# EAGLE design colourgrid3-r1 (EAGLE 5.12)
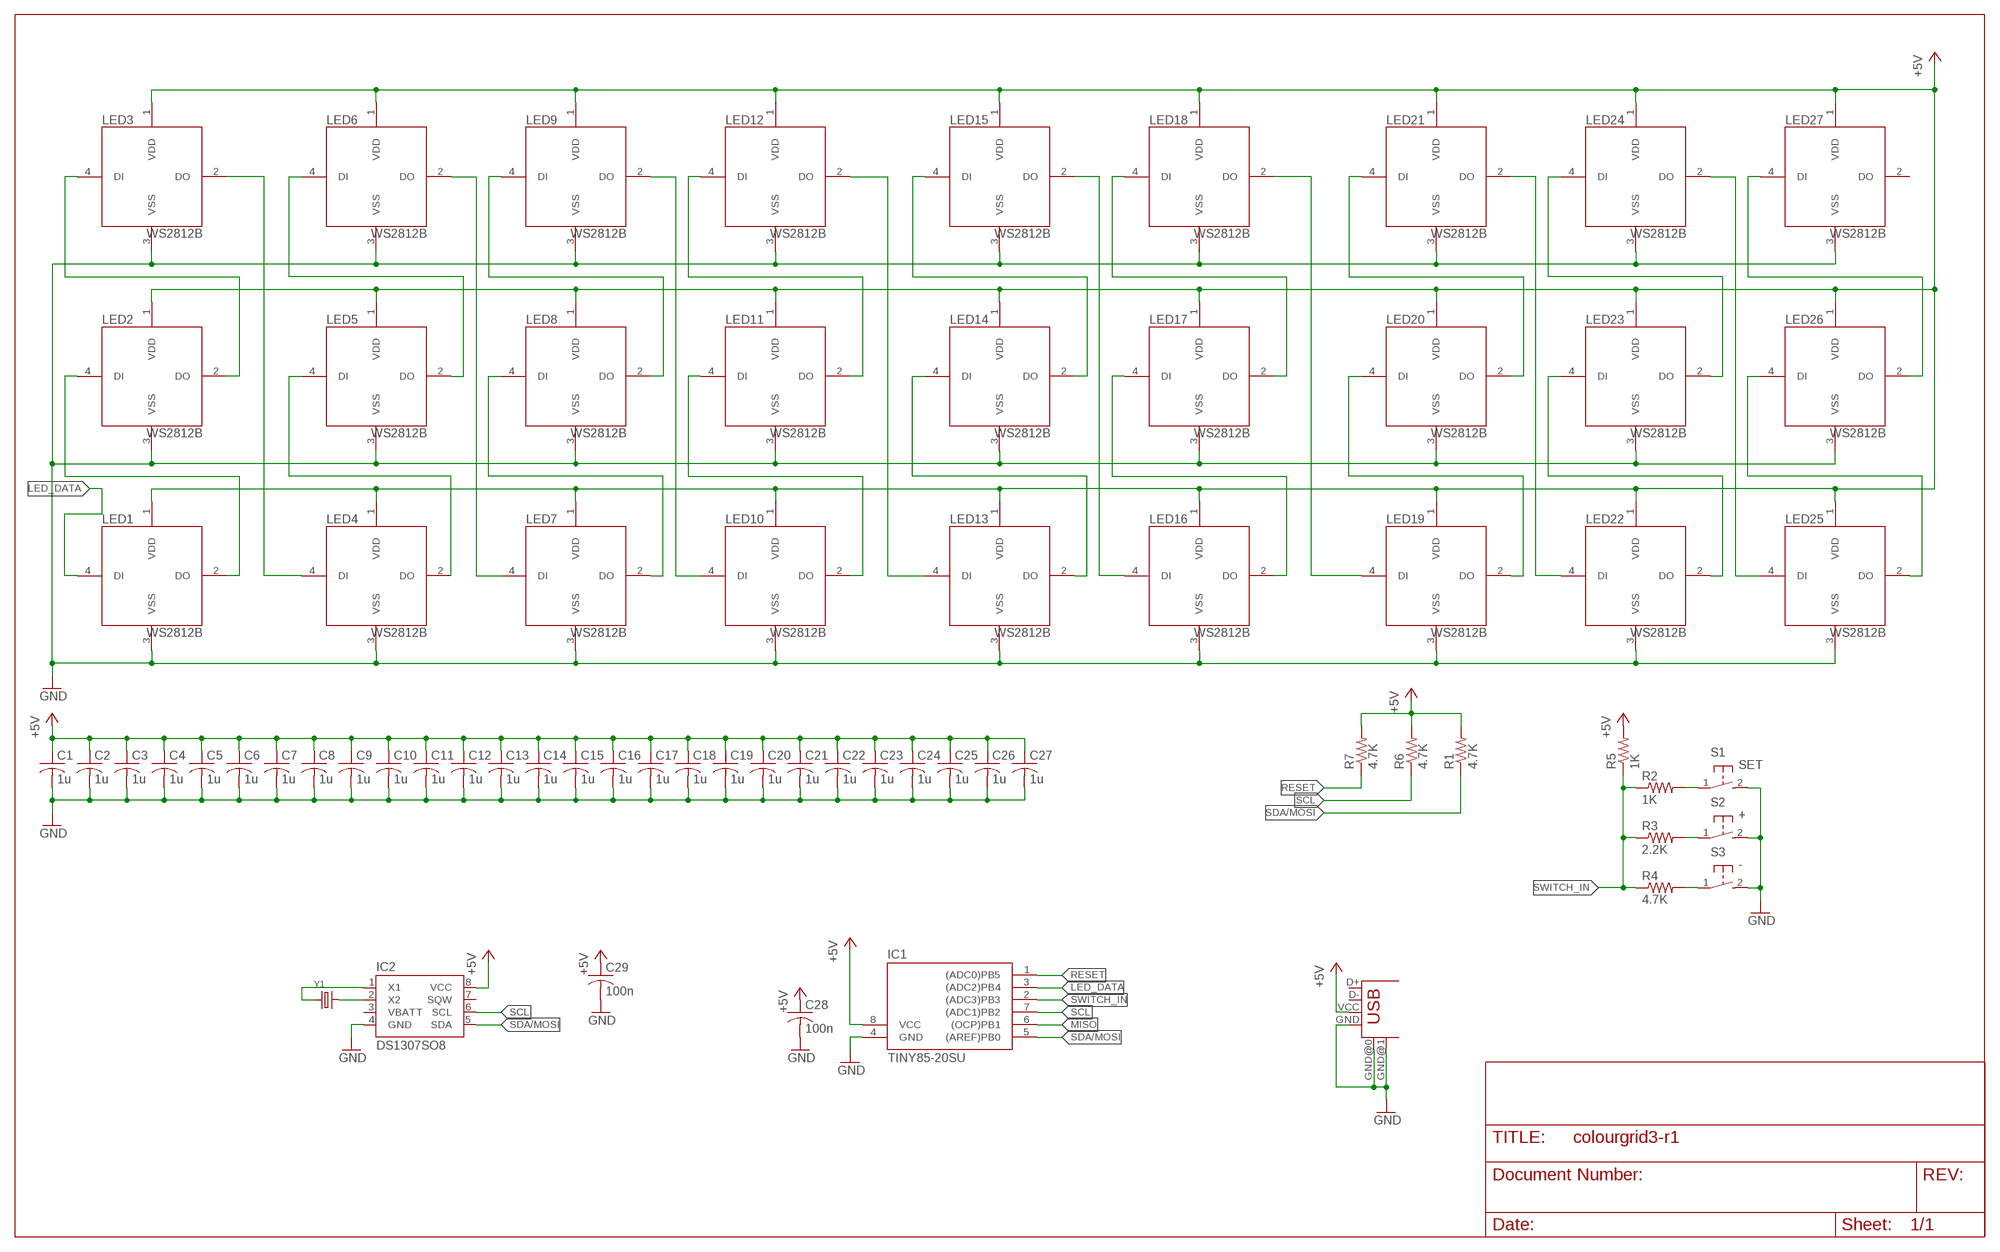
[diagram p0: schematic, sheet 1]

## Parts
C1  1u  C-USC0402  [C0402]
C2  1u  C-USC0402  [C0402]
C3  1u  C-USC0402  [C0402]
C4  1u  C-USC0402  [C0402]
C5  1u  C-USC0402  [C0402]
C6  1u  C-USC0402  [C0402]
C7  1u  C-USC0402  [C0402]
C8  1u  C-USC0402  [C0402]
C9  1u  C-USC0402  [C0402]
C10  1u  C-USC0402  [C0402]
C11  1u  C-USC0402  [C0402]
C12  1u  C-USC0402  [C0402]
C13  1u  C-USC0402  [C0402]
C14  1u  C-USC0402  [C0402]
C15  1u  C-USC0402  [C0402]
C16  1u  C-USC0402  [C0402]
C17  1u  C-USC0402  [C0402]
C18  1u  C-USC0402  [C0402]
C19  1u  C-USC0402  [C0402]
C20  1u  C-USC0402  [C0402]
C21  1u  C-USC0402  [C0402]
C22  1u  C-USC0402  [C0402]
C23  1u  C-USC0402  [C0402]
C24  1u  C-USC0402  [C0402]
C25  1u  C-USC0402  [C0402]
C26  1u  C-USC0402  [C0402]
C27  1u  C-USC0402  [C0402]
C28  100n  C-USC0402  [C0402]
C29  100n  C-USC0402  [C0402]
IC1  TINY85-20SU  TINY25-20SU  [SOIC8]
IC2  DS1307SO8  [SO08]
LED1  WS2812B  [LED-TRICOLOR-5050-4PIN]
LED2  WS2812B  [LED-TRICOLOR-5050-4PIN]
LED3  WS2812B  [LED-TRICOLOR-5050-4PIN]
LED4  WS2812B  [LED-TRICOLOR-5050-4PIN]
LED5  WS2812B  [LED-TRICOLOR-5050-4PIN]
LED6  WS2812B  [LED-TRICOLOR-5050-4PIN]
LED7  WS2812B  [LED-TRICOLOR-5050-4PIN]
LED8  WS2812B  [LED-TRICOLOR-5050-4PIN]
LED9  WS2812B  [LED-TRICOLOR-5050-4PIN]
LED10  WS2812B  [LED-TRICOLOR-5050-4PIN]
LED11  WS2812B  [LED-TRICOLOR-5050-4PIN]
LED12  WS2812B  [LED-TRICOLOR-5050-4PIN]
LED13  WS2812B  [LED-TRICOLOR-5050-4PIN]
LED14  WS2812B  [LED-TRICOLOR-5050-4PIN]
LED15  WS2812B  [LED-TRICOLOR-5050-4PIN]
LED16  WS2812B  [LED-TRICOLOR-5050-4PIN]
LED17  WS2812B  [LED-TRICOLOR-5050-4PIN]
LED18  WS2812B  [LED-TRICOLOR-5050-4PIN]
LED19  WS2812B  [LED-TRICOLOR-5050-4PIN]
LED20  WS2812B  [LED-TRICOLOR-5050-4PIN]
LED21  WS2812B  [LED-TRICOLOR-5050-4PIN]
LED22  WS2812B  [LED-TRICOLOR-5050-4PIN]
LED23  WS2812B  [LED-TRICOLOR-5050-4PIN]
LED24  WS2812B  [LED-TRICOLOR-5050-4PIN]
LED25  WS2812B  [LED-TRICOLOR-5050-4PIN]
LED26  WS2812B  [LED-TRICOLOR-5050-4PIN]
LED27  WS2812B  [LED-TRICOLOR-5050-4PIN]
R1  4.7K  R-US_R0402  [R0402]
R2  1K  R-US_R0402  [R0402]
R3  2.2K  R-US_R0402  [R0402]
R4  4.7K  R-US_R0402  [R0402]
R5  1K  R-US_R0402  [R0402]
R6  4.7K  R-US_R0402  [R0402]
R7  4.7K  R-US_R0402  [R0402]
S1  SET  TACT-SPSTSMD-6X3.6  [6X3.6-SPST]
S2  +  TACT-SPSTSMD-6X3.6  [6X3.6-SPST]
S3  -  TACT-SPSTSMD-6X3.6  [6X3.6-SPST]
USB1  USB-U  [USB-MICROB-ALI]
Y1  CRYSTAL32.768  [CRYSTAL32SMT]

## Nets
+5V: C1.1 C2.1 C3.1 C4.1 C5.1 C6.1 C7.1 C8.1 C9.1 C10.1 C11.1 C12.1 C13.1 C14.1 C15.1 C16.1 C17.1 C18.1 C19.1 C20.1 C21.1 C22.1 C23.1 C24.1 C25.1 C26.1 C27.1 C28.1 C29.1 IC1.8(VCC) IC2.8(VCC) LED1.1(VDD) LED2.1(VDD) LED3.1(VDD) LED4.1(VDD) LED5.1(VDD) LED6.1(VDD) LED7.1(VDD) LED8.1(VDD) LED9.1(VDD) LED10.1(VDD) LED11.1(VDD) LED12.1(VDD) LED13.1(VDD) LED14.1(VDD) LED15.1(VDD) LED16.1(VDD) LED17.1(VDD) LED18.1(VDD) LED19.1(VDD) LED20.1(VDD) LED21.1(VDD) LED22.1(VDD) LED23.1(VDD) LED24.1(VDD) LED25.1(VDD) LED26.1(VDD) LED27.1(VDD) R1.2 R5.2 R6.2 R7.2 USB1.VCC(VBUS)
GND: C1.2 C2.2 C3.2 C4.2 C5.2 C6.2 C7.2 C8.2 C9.2 C10.2 C11.2 C12.2 C13.2 C14.2 C15.2 C16.2 C17.2 C18.2 C19.2 C20.2 C21.2 C22.2 C23.2 C24.2 C25.2 C26.2 C27.2 C28.2 C29.2 IC1.4(GND) IC2.4(GND) LED1.3(VSS) LED2.3(VSS) LED3.3(VSS) LED4.3(VSS) LED5.3(VSS) LED6.3(VSS) LED7.3(VSS) LED8.3(VSS) LED9.3(VSS) LED10.3(VSS) LED11.3(VSS) LED12.3(VSS) LED13.3(VSS) LED14.3(VSS) LED15.3(VSS) LED16.3(VSS) LED17.3(VSS) LED18.3(VSS) LED19.3(VSS) LED20.3(VSS) LED21.3(VSS) LED22.3(VSS) LED23.3(VSS) LED24.3(VSS) LED25.3(VSS) LED26.3(VSS) LED27.3(VSS) S1.2(S) S2.2(S) S3.2(S) USB1.GND USB1.GND@0(GND) USB1.GND@1(GND)
LED_DATA: IC1.3((ADC2)PB4) LED1.4(DI)
MISO: IC1.6((OCP)PB1)
N$1: LED1.2(DO) LED2.4(DI)
N$2: LED2.2(DO) LED3.4(DI)
N$3: LED3.2(DO) LED4.4(DI)
N$4: LED4.2(DO) LED5.4(DI)
N$5: LED5.2(DO) LED6.4(DI)
N$6: LED6.2(DO) LED7.4(DI)
N$7: LED9.2(DO) LED10.4(DI)
N$8: LED7.2(DO) LED8.4(DI)
N$9: LED10.2(DO) LED11.4(DI)
N$10: LED8.2(DO) LED9.4(DI)
N$11: LED11.2(DO) LED12.4(DI)
N$12: LED12.2(DO) LED13.4(DI)
N$13: LED13.2(DO) LED14.4(DI)
N$14: LED14.2(DO) LED15.4(DI)
N$15: LED17.2(DO) LED18.4(DI)
N$16: LED16.2(DO) LED17.4(DI)
N$17: LED15.2(DO) LED16.4(DI)
N$18: LED20.2(DO) LED21.4(DI)
N$19: LED21.2(DO) LED22.4(DI)
N$20: LED19.2(DO) LED20.4(DI)
N$21: LED22.2(DO) LED23.4(DI)
N$22: LED23.2(DO) LED24.4(DI)
N$23: LED24.2(DO) LED25.4(DI)
N$24: LED25.2(DO) LED26.4(DI)
N$25: LED26.2(DO) LED27.4(DI)
N$26: LED18.2(DO) LED19.4(DI)
N$27: IC2.1(X1) Y1.1
N$28: IC2.2(X2) Y1.2
N$29: R2.2 S1.1(P)
N$30: R3.2 S2.1(P)
N$31: R4.2 S3.1(P)
RESET: IC1.1((ADC0)PB5) R7.1
SCL: IC1.7((ADC1)PB2) IC2.6(SCL) R6.1
SDA/MOSI: IC1.5((AREF)PB0) IC2.5(SDA) R1.1
SWITCH_IN: IC1.2((ADC3)PB3) R2.1 R3.1 R4.1 R5.1
Unconnected: IC2.3(VBATT) IC2.7(SQW) LED27.2(DO) USB1.D+ USB1.D-

## Library data of the parts
C1-C29 = rcl:C-US: CAPACITOR, American symbol
IC1 = avr-5-4.16:TINY25
IC2 = SparkFun:DS1307
LED1-LED27 = rbg-worldsemi-led:WS2812B
R1-R7 = rcl:R-US_: RESISTOR, American symbol
S1-S3 = rbg-generic-tact-switch:TACT-SPST
USB1 = con-usb-2:USB: USB Connectors
Y1 = microbuilder:CRYSTAL: Crystals HC49UP - Surface Mount Crystal 4.0MHz 18pF +/-30ppm Surface Mount Crystal [Digikey: 535-9857-1-ND] 12.0 MHz Surface Mount Crystal [Digikey: 535-9869-6-ND] 25.0 MHz Surface Mount Crystal [Digikey: 535-9078-1-ND] 3.2 x 2.5mm - MEMs SMT Crystal 12.0 MHz 8pF 15ppm 3.2 x 2.5mm Crystal [Digikey: -10-70°C: 644-1047-1-ND -40-125°C: 644-1128-1-ND] 16.0 MHz 8pF 15ppm 3.2 x 2.5mm Crystal [Digikey: -10-70°C: 644-1049-1-ND -40-125°C: 644-1129-2-ND] 16.0 MHz 10pF 10ppm 3.2 x 2.5mm Crystal [Digikey: 644-1100-1-ND] 27.12 MHz 18pF 30ppm 3.2 x 2.5mm Crystal [Digikey: 887-1424-1-ND] 27.12MHz 10pF 10ppm 3.2 x 2.5mm Crystal [Digikey: 887-1329-1-ND] 4.9 x 1.8mm - MEMs SMT Crystal 32.768 KHz 12.5pF 20ppm 4.9 x 1.8mm Crystal [Digikey: SE2415CT-ND] Cylinder 32.768KHz Cylinder Crystal

## Board
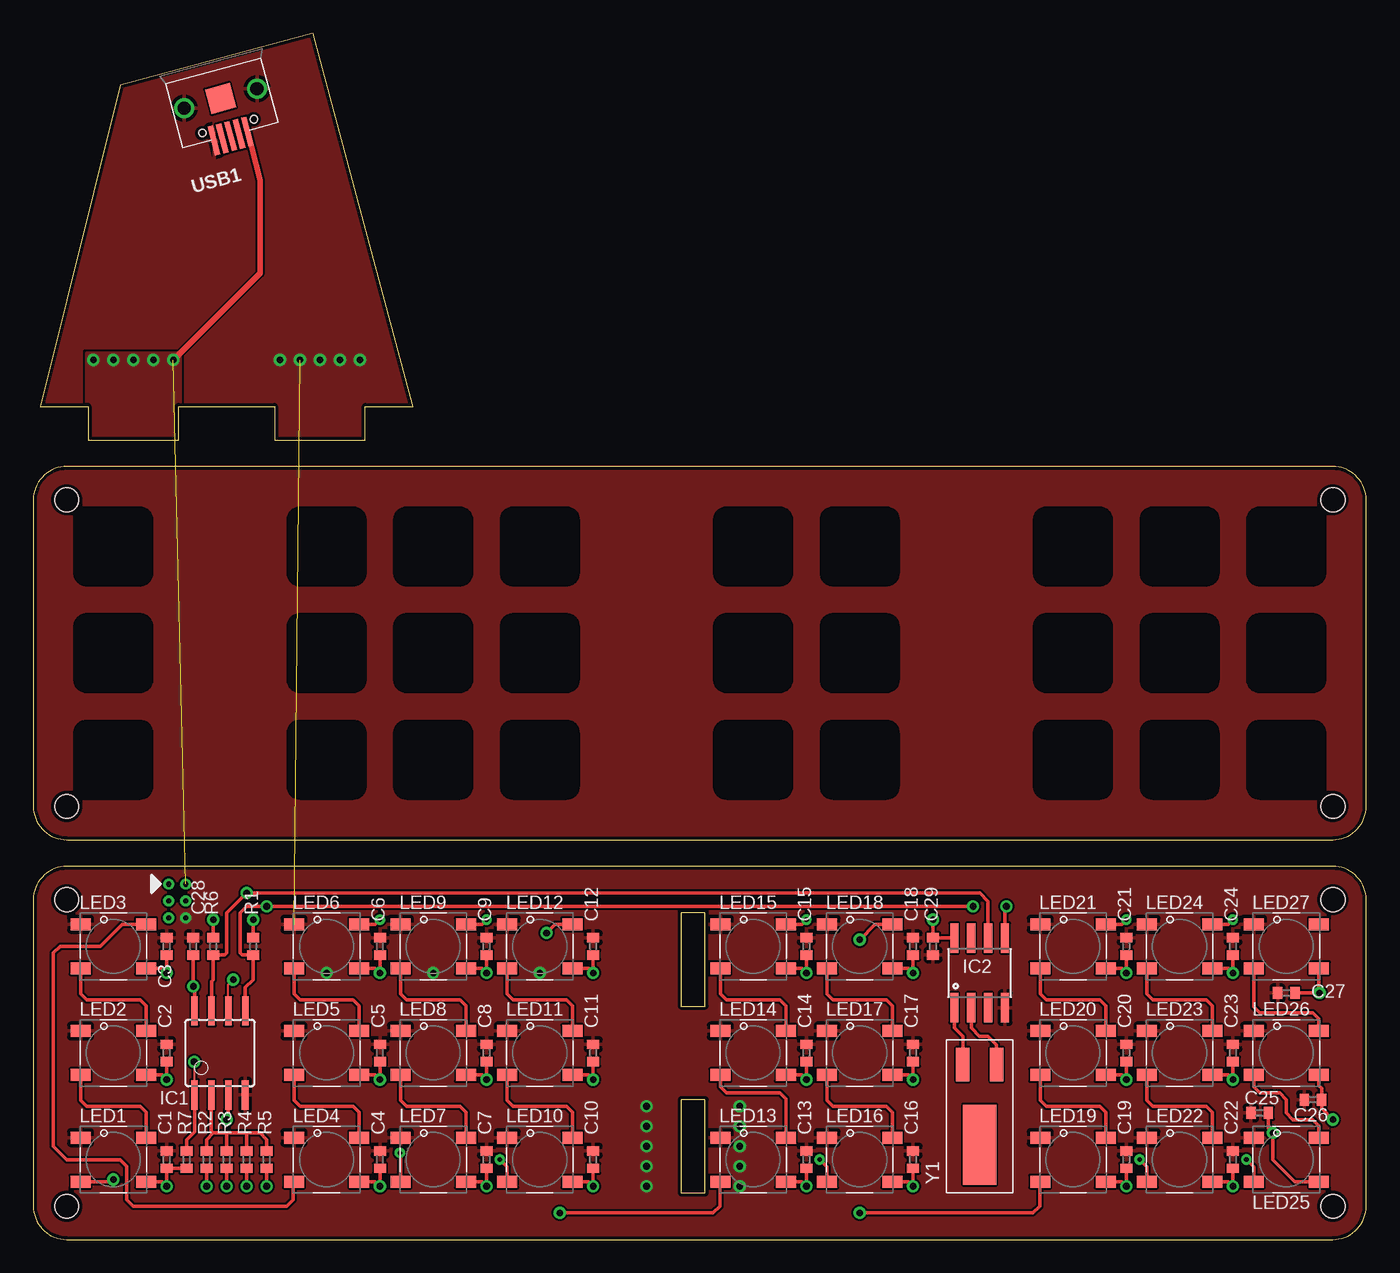
[diagram p1: board, top side]
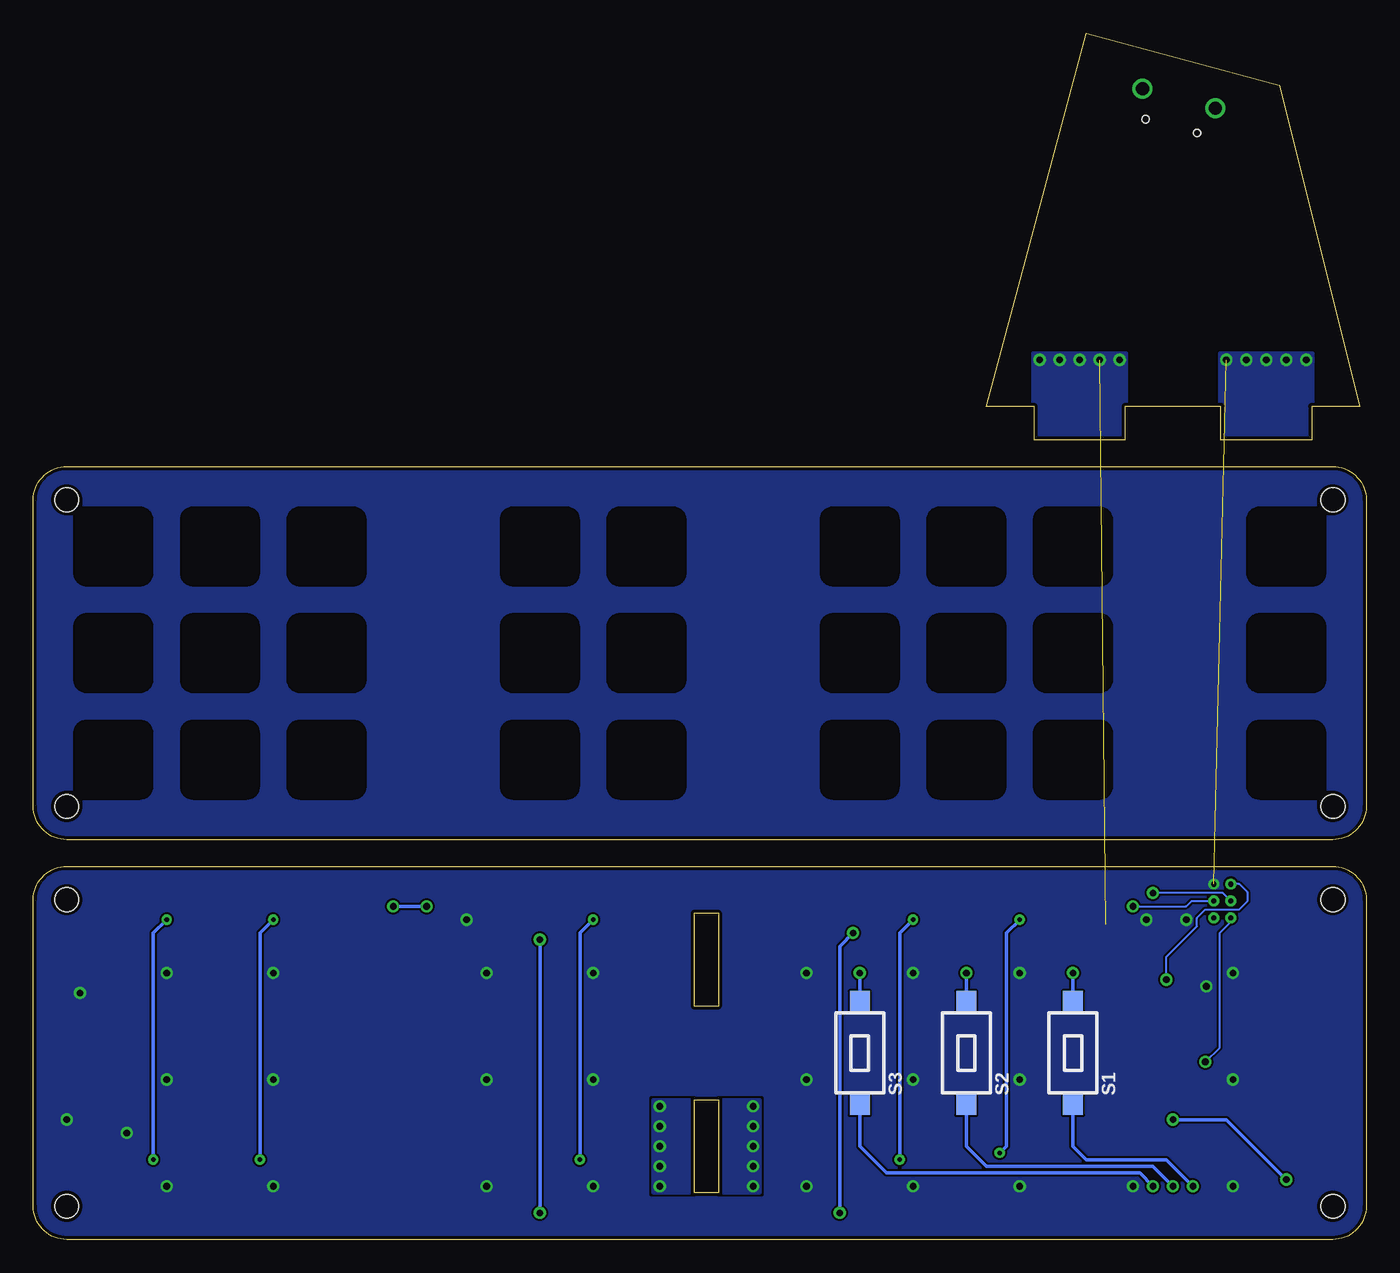
[diagram p2: board, bottom side, seen from below]

Size 100 x 90.5 mm. Coordinates in mm from the lower left corner, seen from the top.
Outline: 100,25.5 arc90 97.5,28 2.5,28 arc90 0,25.5 0,2.5 arc90 2.5,0 97.5,0 arc90 100,2.5 100,25.5
Outline: 100,55.5 arc90 97.5,58 2.5,58 arc90 0,55.5 0,32.5 arc90 2.5,30 97.5,30 arc90 100,32.5 100,55.5
Outline: 48.6,24.5 48.6,17.5 50.4,17.5 50.4,24.5 48.6,24.5
Outline: 48.6,10.5 48.6,3.5 50.4,3.5 50.4,10.5 48.6,10.5
Outline: 0.5,62.5 4.1,62.5 4.1,60 10.9,60 10.9,62.5 18.1,62.5 18.1,60 24.9,60 24.9,62.5 28.5,62.5 21,90.5 6.51,86.62 0.5,62.5
Copper layers (1*16): Top 0.035mm / dielectric 1.5mm / Bottom 0.035mm
Design rules "default *": minimum track width 6mil, minimum drill 12mil, track to track 6mil, track to pad 6mil, pad to pad 6mil, via to via 6mil, smd to smd 6mil, copper to edge 10mil, drill to drill 8mil, minimum pad ring 10mil, minimum via ring 8mil, stop-mask expansion 4mil, vias tented up to drill 20mil, thermal gap 10mil
Holes 1.8 mm at 2.5,32.5 2.5,55.5 97.5,55.5 97.5,32.5 97.5,25.5 97.5,2.5 2.5,2.5 2.5,25.5
tRestrict: area 3,33 to 9,39; area 3,41 to 9,47; area 3,49 to 9,55; area 19,33 to 25,39; area 19,41 to 25,47; area 19,49 to 25,55; area 27,33 to 33,39; area 27,41 to 33,47; area 27,49 to 33,55; area 35,33 to 41,39; area 35,41 to 41,47; area 35,49 to 41,55; 15 more areas
bRestrict: area 3,49 to 9,55; area 3,41 to 9,47; area 3,33 to 9,39; area 19,49 to 25,55; area 19,41 to 25,47; area 19,33 to 25,39; area 27,49 to 33,55; area 27,41 to 33,47; area 27,33 to 33,39; area 35,49 to 41,55; area 35,41 to 41,47; area 35,33 to 41,39; 15 more areas

### Footprints (pad centres in the part's own frame; a part is rotated, then mirrored left to right if it is on the bottom)
C0402 = smd 0.7 x 0.9: 1 -0.65,0; 2 0.65,0
SOIC8 = smd 0.5 x 2.2: 1 -1.905,-3.154; 2 -0.645,-3.154; 3 0.625,-3.154; 4 1.895,-3.154; 5 1.905,3.154; 6 0.635,3.154; 7 -0.635,3.154; 8 -1.905,3.154
SO08 = smd 0.61 x 2.21: 1 -1.905,-2.616; 2 -0.635,-2.616; 3 0.635,-2.616; 4 1.905,-2.616; 5 1.905,2.616; 6 0.635,2.616; 7 -0.635,2.616; 8 -1.905,2.616
LED-TRICOLOR-5050-4PIN = smd 1.5 x 0.9: 1 2.45,-1.65; 2 2.45,1.65; 3 -2.45,1.65; 4 -2.45,-1.65
R0402 = smd 0.7 x 0.9: 1 -0.65,0; 2 0.65,0
6X3.6-SPST = smd 1.5 x 1.5: 1 -3.9,0; 2 3.9,0
USB-MICROB-ALI = smd 0.4 x 2.25: D+ 0,2.925; D- -0.65,2.925; GND 1.3,2.925; ID 0.65,2.925; VCC -1.3,2.925 | drill 1 round: GND@0 -2.825,0; GND@1 2.825,0 | smd 1.9 x 1.9: GND@2 0,0 | hole 0.55: -2,2.15; 2,2.15
CRYSTAL32SMT = smd 2.5 x 1: 1 2.125,1.27; 2 2.125,-1.27 | smd 6 x 2.5: CYLINDER -3.875,0

### Placement (x,y rotation side)
C1  10,6 90 top
C2  10,14 90 top
C3  10,22 90 top
C4  26,6 90 top
C5  26,14 90 top
C6  26,22 90 top
C7  34,6 90 top
C8  34,14 90 top
C9  34,22 90 top
C10  42,6 90 top
C11  42,14 90 top
C12  42,22 90 top
C13  58,6 90 top
C14  58,14 90 top
C15  58,22 90 top
C16  66,6 90 top
C17  66,14 90 top
C18  66,22 90 top
C19  82,6 90 top
C20  82,14 90 top
C21  82,22 90 top
C22  90,6 90 top
C23  90,14 90 top
C24  90,22 90 top
C25  92,9.5 180 top
C26  96,10.5 180 top
C27  94,18.5 180 top
C28  12,22 90 top
C29  67.5,22 270 top
IC1  14,14 0 top
IC2  71,20 0 top
LED1  6,6 0 top
LED2  6,14 0 top
LED3  6,22 0 top
LED4  22,6 0 top
LED5  22,14 0 top
LED6  22,22 0 top
LED7  30,6 0 top
LED8  30,14 0 top
LED9  30,22 0 top
LED10  38,6 0 top
LED11  38,14 0 top
LED12  38,22 0 top
LED13  54,6 0 top
LED14  54,14 0 top
LED15  54,22 0 top
LED16  62,6 0 top
LED17  62,14 0 top
LED18  62,22 0 top
LED19  78,6 0 top
LED20  78,14 0 top
LED21  78,22 0 top
LED22  86,6 0 top
LED23  86,14 0 top
LED24  86,22 0 top
LED25  94,6 0 top
LED26  94,14 0 top
LED27  94,22 0 top
R1  16.5,22 90 top
R2  13,6 270 top
R3  14.5,6 270 top
R4  16,6 270 top
R5  17.5,6 270 top
R6  13.5,22 90 top
R7  11.5,6 270 top
S1  22,14 90 bottom
S2  30,14 90 bottom
S3  38,14 90 bottom
USB1  14.05,85.61 195 top
Y1  71,11 90 top

### Tracks (layer width: path | path; a pad name or v marks a point on that pad's centre or on a via)
+5V  (via drill 0.4, 0.5)  (1 unrouted)
  Top 0.254: C2.1 v10,12 9.65,12.35 LED2.1 | LED1.1 9.65,4.35 v10,4 C1.1 R7.2 | C3.1 v10,20 9.65,20.35 LED3.1 | C24.1 v90,20 89.65,20.35 LED24.1 | C21.1 v82,20 81.65,20.35 LED21.1 | C20.1 v82,12 81.65,12.35 LED20.1 | C19.1 v82,4 81.65,4.35 LED19.1 | C23.1 v90,12 89.65,12.35 LED23.1 | C22.1 v90,4 89.65,4.35 LED22.1 | C18.1 v66,20 65.65,20.35 LED18.1 | C15.1 v58,20 57.65,20.35 LED15.1 | C17.1 v66,12 65.65,12.35 LED17.1 | C14.1 v58,12 57.65,12.35 LED14.1 | C16.1 v66,4 65.65,4.35 LED16.1 | C13.1 v58,4 57.65,4.35 LED13.1 | C12.1 v42,20 41.65,20.35 LED12.1 | C11.1 v42,12 41.65,12.35 LED11.1 | C10.1 v42,4 41.65,4.35 LED10.1 | C7.1 v34,4 33.65,4.35 LED7.1 | C8.1 v34,12 33.65,12.35 LED8.1 | C9.1 v34,20 33.65,20.35 LED9.1 | C6.1 v26,20 25.65,20.35 LED6.1 | C5.1 v26,12 25.65,12.35 LED5.1 | C4.1 v26,4 25.65,4.35 LED4.1 | IC1.8 12.1,18.91 v12,19 C28.1 | v17.5,4 R5.2 | IC2.8 67.53,22.62 C29.1 v67.5,24 | R6.2 v13.5,24 | R1.2 v16.5,24 | C25.1 92.65,8.35 v93,8 93,6 94.65,4.35 LED25.1 | LED26.1 96.45,11.55 96.65,11.35 C26.1 96.65,9.85 v97.5,9 | C27.1 v96.5,18.5 96.45,18.55 LED27.1
  Top 0.406: USB1.VCC 17,79.5 17,72.5 v10.5,66
  other vias: 9,66 7.5,66 6,66 4.5,66 11.43,26.67
  pour Bottom (rank 2): 0,28 0,0 100,0 100,28
  pour Top: 4,60 11,60 11,66.5 4,66.5
  pour Bottom: 4,60 11,60 11,66.5 4,66.5
GND  (via drill 0.4, 0.5)  (1 unrouted)
  Bottom 0.254: S1.2 v22,20 | S2.2 v30,20 | S3.2 v38,20
  other vias: 46,10 46,8.5 46,7 46,5.5 46,4 53,10 53,8.5 53,7 53,5.5 53,4 18.5,66 20,66 21.5,66 23,66 24.5,66 11.43,24.13
  pour Top: 0,28 100,28 100,0 0,0
  pour Bottom: 45.5,10.5 49,10.5 49,3.5 45.5,3.5
  pour Bottom: 50,10.5 53.5,10.5 53.5,3.5 50,3.5
  pour Top (rank 2): 0,60 28.5,60 28.5,91 0,91
  pour Bottom: 18,60 25,60 25,66.5 18,66.5
LED_DATA  (via drill 0.5)
  Top 0.254: IC1.3 14.62,9.12 v14.5,9 | LED1.4 5.85,4.35 v6,4.5
  Bottom 0.254: v14.5,9 10.5,9 v6,4.5
MISO  (via drill 0.4, 0.5)
  Top 0.152: IC1.6 14.63,19.14 v15,19.5
  Bottom 0.152: v15,19.5 15,21.2 12.7,23.5 12.7,24.13 12.06,24.77 9.53,24.77 8.89,25.4 8.89,26.04 9.53,26.67 v10.16,26.67
N$1
  Top 0.254: LED2.4 3.55,10.45 4,10 8,10 8.45,9.55 LED1.2
N$2
  Top 0.254: LED3.4 3.55,18.45 4,18 8,18 8.45,17.55 LED2.2
N$3
  Top 0.254: LED3.2 6.65,23.65 5,22 2,22 1.5,21.5 1.5,7 2.5,6 6.5,6 7,5.5 7,3 7.5,2.5 19,2.5 19.5,3 19.5,4.3 LED4.4
N$4
  Top 0.254: LED5.4 19.55,10.45 20,10 24,10 24.45,9.55 LED4.2
N$5
  Top 0.254: LED6.4 19.55,18.45 20,18 24,18 24.45,17.55 LED5.2
N$6  (via drill 0.35)
  Top 0.254: LED6.2 25.65,23.65 v26,24 | LED7.4 27.55,6.45 v27.5,6.5
  Bottom 0.254: v26,24 27,23 27,7 v27.5,6.5
N$7  (via drill 0.35)
  Top 0.254: LED9.2 33.65,23.65 v34,24 | LED10.4 35.55,5.45 v35,6
  Bottom 0.254: v34,24 35,23 v35,6
N$8
  Top 0.254: LED8.4 27.55,10.45 28,10 32,10 32.45,9.55 LED7.2
N$9
  Top 0.254: LED11.4 35.55,10.45 36,10 40,10 40.45,9.55 LED10.2
N$10
  Top 0.254: LED9.4 27.55,18.45 28,18 32,18 32.45,17.55 LED8.2
N$11
  Top 0.254: LED12.4 35.55,18.45 36,18 40,18 40.45,17.55 LED11.2
N$12  (via drill 0.5)
  Top 0.254: LED12.2 39.15,23.65 v38.5,23 | v39.5,2 51,2 51.5,2.5 51.5,4.3 LED13.4
  Bottom 0.254: v38.5,23 39.5,22 v39.5,2
N$13
  Top 0.254: LED14.4 51.55,11.45 52,11 56,11 56.45,10.55 LED13.2
N$14
  Top 0.254: LED15.4 51.55,18.45 52,18 56,18 56.45,17.55 LED14.2
N$15
  Top 0.254: LED18.4 59.55,18.45 60,18 64,18 64.45,17.55 LED17.2
N$16
  Top 0.254: LED17.4 59.55,10.45 60,10 64,10 64.45,9.55 LED16.2
N$17  (via drill 0.35)
  Top 0.254: LED15.2 57.65,23.65 v58,24 | LED16.4 59.55,5.45 v59,6
  Bottom 0.254: v58,24 59,23 v59,6
N$18
  Top 0.254: LED21.4 75.55,18.45 76,18 80,18 80.45,17.55 LED20.2
N$19  (via drill 0.35)
  Top 0.254: LED21.2 81.65,23.65 v82,24 | LED22.4 83.55,5.45 v83,6
  Bottom 0.254: v82,24 83,23 v83,6
N$20
  Top 0.254: LED19.2 80.45,9.55 80,10 76,10 75.55,10.45 LED20.4
N$21
  Top 0.254: LED23.4 83.55,10.45 84,10 88,10 88.45,9.55 LED22.2
N$22
  Top 0.254: LED24.4 83.55,18.45 84,18 88,18 88.45,17.55 LED23.2
N$23  (via drill 0.35)
  Top 0.254: LED24.2 89.65,23.65 v90,24 | LED25.4 91.55,5.45 v91,6
  Bottom 0.254: v90,24 91,23 v91,6
N$24
  Top 0.254: LED26.4 91.55,11.45 92,11 93,11 93.5,11 94,10.5 94,9.5 94.5,9 96,9 96.45,8.55 LED25.2
N$25
  Top 0.254: LED27.4 91.55,17.45 92,17 96,17 96.45,16.55 LED26.2
N$26  (via drill 0.5)
  Top 0.254: LED18.2 63.15,23.65 v62,22.5 | v62,2 75,2 75.5,2.5 75.5,4.3 LED19.4
  Bottom 0.254: v62,2 v62,22.5
N$27
  Top 0.254: IC2.1 69.09,15.87 69.73,15.23 Y1.1
N$28
  Top 0.254: IC2.2 70.36,15.87 70.99,15.24 71.62,15.24 72.27,14.6 Y1.2
N$29  (via drill 0.5)
  Top 0.254: v13,4 R2.2
  Bottom 0.254: S1.1 22,7 21,6 15,6 v13,4
N$30  (via drill 0.5)
  Top 0.254: v14.5,4 R3.2
  Bottom 0.254: S2.1 30,7 28.5,5.5 16,5.5 v14.5,4
N$31  (via drill 0.5)
  Top 0.254: v16,4 R4.2
  Bottom 0.254: S3.1 38,7 36,5 17,5 v16,4
N$32
  pour Top (rank 2): 0,32.5 arc90 2.5,30 97.5,30 arc90 100,32.5 100,55.5 arc90 97.5,58 2.5,58 arc90 0,55.5
  pour Bottom (rank 2): 0,32.5 arc90 2.5,30 97.5,30 arc90 100,32.5 100,55.5 arc90 97.5,58 2.5,58 arc90 0,55.5
RESET  (via drill 0.4, 0.5)
  Top 0.152: IC1.1 12.1,13.3 v12.06,13.34
  Top 0.254: IC1.1 12.1,8.1 11.5,7.5 R7.1
  Bottom 0.152: v10.16,24.13 10.16,23.84 11,23 11,14.4 v12.06,13.34
SCL  (via drill 0.4, 0.5)
  Top 0.254: IC1.7 13.37,19.36 13.5,19.5 R6.1 14.35,21.35 14.5,21.5 14.5,24.5 v16,26 71,26 71.64,25.36 IC2.6
  Bottom 0.152: v10.16,25.4 10.79,26.04 15.96,26.04 v16,26
SDA/MOSI  (via drill 0.4, 0.5)
  Top 0.254: IC1.5 15.9,18.91 16.5,19.5 R1.1 15.65,21.35 15.5,21.5 15.5,24.5 16,25 v17.5,25 v70.5,25 | IC2.5 72.91,24.91 v73,25
  Bottom 0.152: v11.43,25.4 13.1,25.4 13.5,25 v17.5,25
  Bottom 0.254: v70.5,25 v73,25
SWITCH_IN
  Top 0.254: R2.1 13,7.5 13.5,8 | 14.5,8 13.5,8 | 14.5,8 16,8 | 16,8 17,8 17.5,7.5 R5.1 | 16,8 R4.1 | R3.1 14.5,8 | IC1.2 13.36,8.14 13.5,8